# EAGLE design USB Hub (EAGLE 7.5.0)
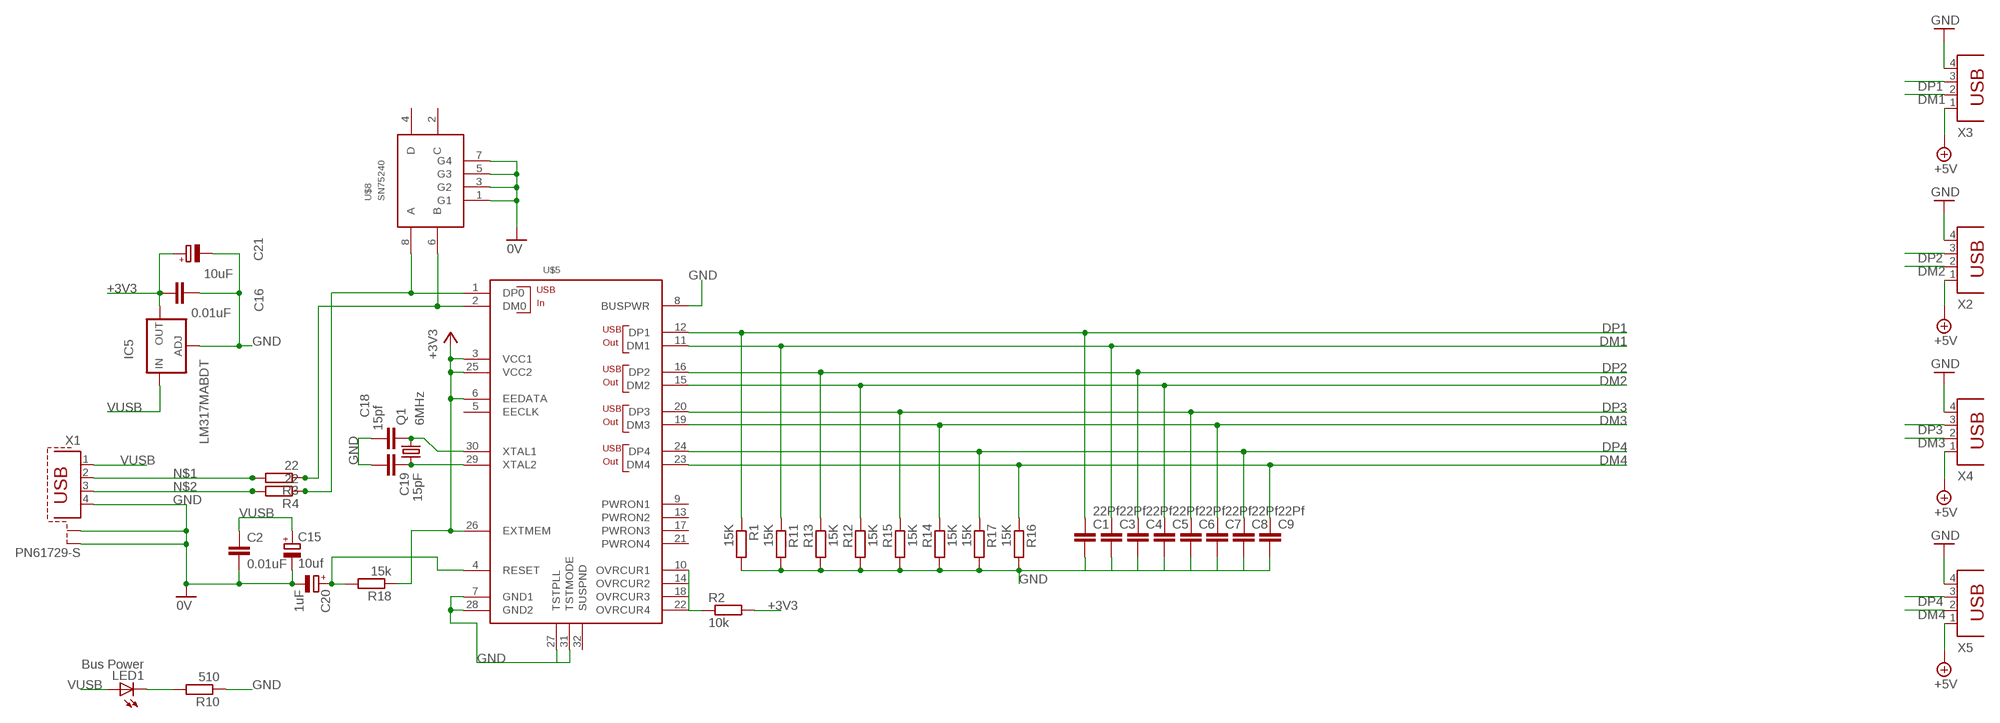
[diagram p0: schematic, sheet 1]

## Parts
C1  22Pf  C-EUC0805  [C0805]
C2  0.01uF  C-EUC0805  [C0805]
C3  22Pf  C-EUC0805  [C0805]
C4  22Pf  C-EUC0805  [C0805]
C5  22Pf  C-EUC0805  [C0805]
C6  22Pf  C-EUC0805  [C0805]
C7  22Pf  C-EUC0805  [C0805]
C8  22Pf  C-EUC0805  [C0805]
C9  22Pf  C-EUC0805  [C0805]
C15  10uf  CPOL-EUE2.5-6  [E2,5-6]
C16  0.01uF  C-EUC0805  [C0805]
C18  15pf  C-EUC0805  [C0805]
C19  15pF  C-EUC0805  [C0805]
C20  1uF  CPOL-EUE2.5-6  [E2,5-6]
C21  10uF  CPOL-EUE2.5-6  [E2,5-6]
IC5  LM317MABDT  [DPACK]
LED1  Bus Power  LEDCHIP-LED0805  [CHIP-LED0805]
Q1  6MHz  CRYSTALHC49UP  [HC49UP]
R1  15K  R-EU_R0805  [R0805]
R2  10k  R-EU_R0805  [R0805]
R3  22  R-EU_R0805  [R0805]
R4  22  R-EU_R0805  [R0805]
R10  510  R-EU_R0805  [R0805]
R11  15K  R-EU_R0805  [R0805]
R12  15K  R-EU_R0805  [R0805]
R13  15K  R-EU_R0805  [R0805]
R14  15K  R-EU_R0805  [R0805]
R15  15K  R-EU_R0805  [R0805]
R16  15K  R-EU_R0805  [R0805]
R17  15K  R-EU_R0805  [R0805]
R18  15k  R-EU_R0805  [R0805]
U$5  TUSB2046  [LQFP-32]
U$8  SN75240  [TSSOP8]
X1  PN61729-S  [PN61729-S]
X2  PN87520  [PN87520]
X3  PN87520  [PN87520]
X4  PN87520  [PN87520]
X5  PN87520  [PN87520]

## Nets
+3V3: C16.1 C21.+ IC5.4(OUT) R2.2 R18.1 U$5.3(VCC1) U$5.6(EEDATA) U$5.25(VCC2) U$5.26(EXTMEM)
DM0: R3.1 U$5.2(DM0) U$8.6(B)
DM1: C3.1 R11.1 U$5.11(DM1) X3.2
DM2: C5.1 R12.1 U$5.15(DM2) X2.2
DM3: C7.1 R14.1 U$5.19(DM3) X4.2
DM4: C9.1 R16.1 U$5.23(DM4) X5.2
DP0: R4.1 U$5.1(DP0) U$8.8(A)
DP1: C1.1 R1.1 U$5.12(DP1) X3.3
DP2: C4.1 R13.1 U$5.16(DP2) X2.3
DP3: C6.1 R15.1 U$5.20(DP3) X4.3
DP4: C8.1 R17.1 U$5.24(DP4) X5.3
GND: C1.2 C2.2 C3.2 C4.2 C5.2 C6.2 C7.2 C8.2 C9.2 C15.- C16.2 C18.1 C19.2 C20.- C21.- IC5.1(ADJ) R1.2 R10.1 R11.2 R12.2 R13.2 R14.2 R15.2 R16.2 R17.2 U$5.7(GND1) U$5.8(BUSPWR) U$5.27(TSTPLL) U$5.28(GND2) U$5.31(TSTMODE) U$8.1(G1) U$8.3(G2) U$8.5(G3) U$8.7(G4) X1.4 X1.S1 X1.S2 X2.4 X3.4 X4.4 X5.4 ; supply symbol labelled 0V
LEDV: LED1.C R10.2
N$1: R3.2 X1.2
N$2: R4.2 X1.3
N$3: R2.1 U$5.10(OVRCUR1) U$5.14(OVRCUR2) U$5.18(OVRCUR3) U$5.22(OVRCUR4)
RESET: C20.+ R18.2 U$5.4(RESET)
VCC: X2.1 X3.1 X4.1 X5.1 ; supply symbol labelled +5V
VUSB: C2.1 C15.+ IC5.3(IN) LED1.A X1.1
XTAL1: C18.2 Q1.2 U$5.30(XTAL1)
XTAL2: C19.1 Q1.1 U$5.29(XTAL2)
Unconnected: U$5.5(EECLK) U$5.9(PWRON1) U$5.13(PWRON2) U$5.17(PWRON3) U$5.21(PWRON4) U$5.32(SUSPND) U$8.2(C) U$8.4(D)

## Library data of the parts
C1-C9 C16 C18 C19 = rcl:C-EU: CAPACITOR, European symbol
C15 C20 C21 = rcl:CPOL-EU: POLARIZED CAPACITOR, European symbol
IC5 = v-reg:LM317?*: 500 mA Adjustable Output Positive Voltage Regulator Source: http://www.onsemi.co.jp .. LM317M-D.PDF
LED1 = led:LED: LED OSRAM: - CHIPLED LG R971, LG N971, LY N971, LG Q971, LY Q971, LO R971, LY R971 LH N974, LH R974 LS Q976, LO Q976, LY Q976 LO Q996 - Hyper CHIPLED LW Q18S LB Q993, LB Q99A, LB R99A - SideLED LS A670, LO A670, LY A670, LG A670, LP A670 LB A673, LV A673, LT A673, LW A673 LH A674 LY A675 LS A676, LA A676, LO A676, LY A676, LW A676 LS A679, LY A679, LG A679 - Hyper Micro SIDELED® LS Y876, LA Y876, LO Y876, LY Y876 LT Y87S - SmartLED LW L88C, LW L88S LB L89C, LB L89S, LG L890 LS L89K, LO L89K, LY L89K LS L896, LA L896, LO L896, LY L896 - TOPLED LS T670, LO T670, LY T670, LG T670, LP T670 LSG T670, LSP T670, LSY T670, LOP T670, LYG T670 LG T671, LOG T671, LSG T671 LB T673, LV T673, LT T673, LW T673 LH T674 LS T676, LA T676, LO T676, LY T676, LB T676, LH T676, LSB T676, LW T676 LB T67C, LV T67C, LT T67C, LS T67K, LO T67K, LY T67K, LW E67C LS E67B, LA E67B, LO E67B, LY E67B, LB E67C, LV E67C, LT E67C LW T67C LS T679, LY T679, LG T679 LS T770, LO T770, LY T770, LG T770, LP T770 LB T773, LV T773, LT T773, LW T773 LH T774 LS E675, LA E675, LY E675, LS T675 LS T776, LA T776, LO T776, LY T776, LB T776 LHGB T686 LT T68C, LB T68C - Hyper Mini TOPLED® LB M676 - Mini TOPLED Santana® LG M470 LS M47K, LO M47K, LY M47K Source: http://www.osram.convergy.de - LUMILED® LXK2-PW12-R00, LXK2-PW12-S00, LXK2-PW14-U00, LXK2-PW14-V00 LXK2-PM12-R00, LXK2-PM12-S00, LXK2-PM14-U00 LXK2-PE12-Q00, LXK2-PE12-R00, LXK2-PE12-S00, LXK2-PE14-T00, LXK2-PE14-U00 LXK2-PB12-K00, LXK2-PB12-L00, LXK2-PB12-M00, LXK2-PB14-N00, LXK2-PB14-P00, LXK2-PB14-Q00 LXK2-PR12-L00, LXK2-PR12-M00, LXK2-PR14-Q00, LXK2-PR14-R00 LXK2-PD12-Q00, LXK2-PD12-R00, LXK2-PD12-S00 LXK2-PH12-R00, LXK2-PH12-S00 LXK2-PL12-P00, LXK2-PL12-Q00, LXK2-PL12-R00 Source: www.luxeon.com
Q1 = new_mcp:CRYSTAL: CRYSTAL
R1-R4 R10-R18 = rcl:R-EU_: RESISTOR, European symbol
U$5 = usb-conc:TUSB2046; ORDERCODE: 1470507; SUPPLIER: farnell
U$8 = usb-conc:SN75240; ORDERCODE: 1207275; SUPPLIER: farnell
X1 = usb-conc:PN61729-S: BERG USB connector
X2-X5 = con-berg:PN87520: BERG USB connector; OC_FARNELL: unknown; OC_NEWARK: unknown

## Net classes
1 power: width 0.6 mm, clearance 0.305 mm

## Board
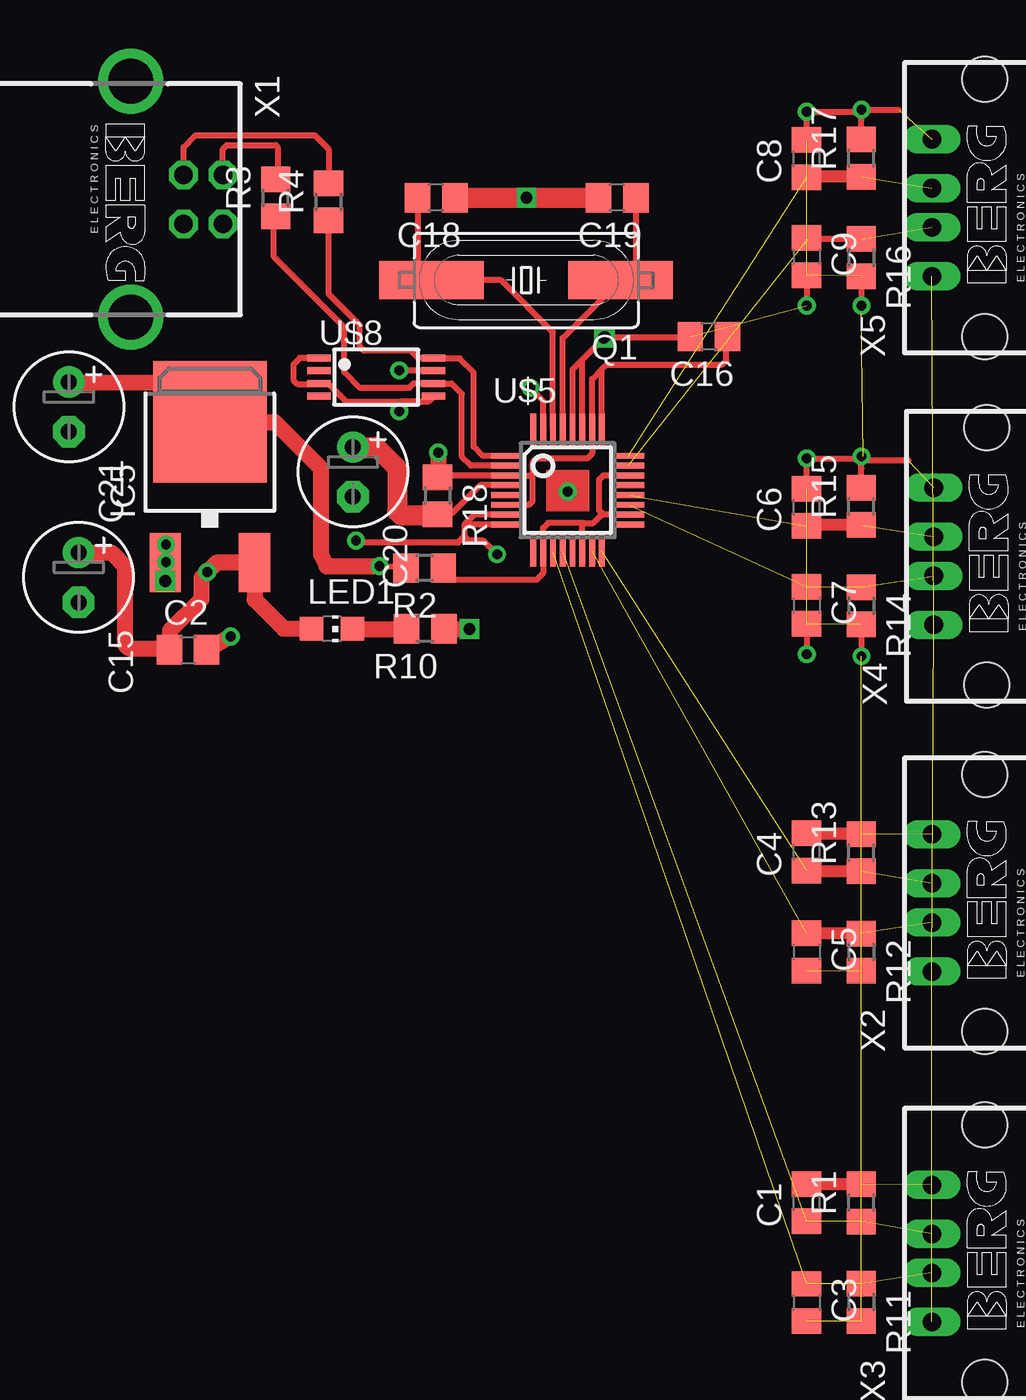
[diagram p1: board, top side]
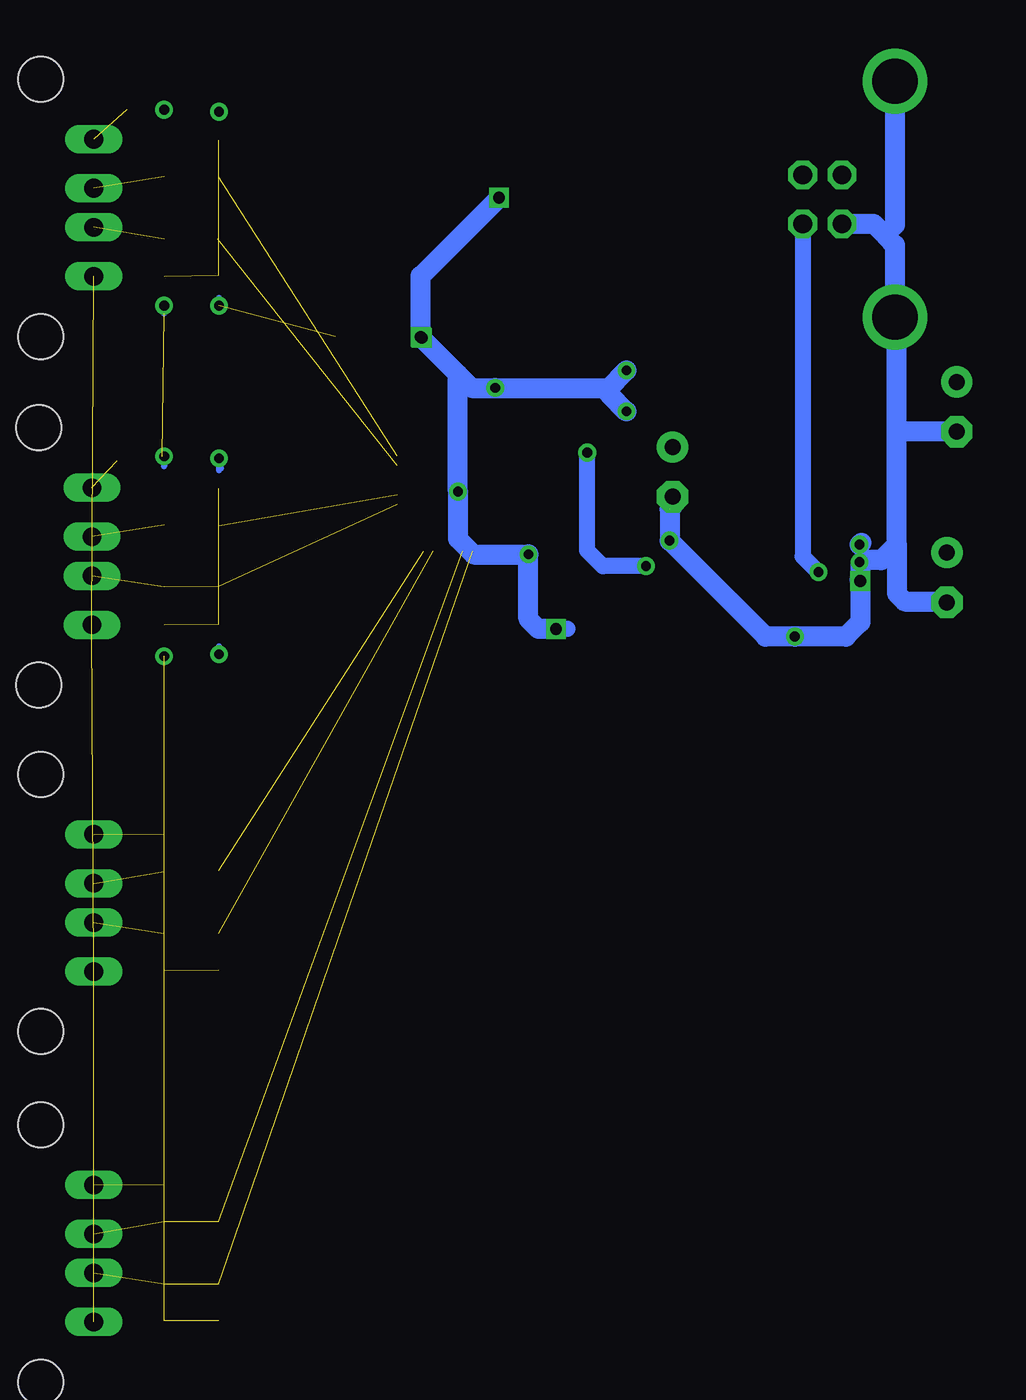
[diagram p2: board, bottom side, seen from below]

No outline drawn. Coordinates in mm, seen from the top.
Copper layers (1*16): Top 0.035mm / dielectric 1.5mm / Bottom 0.035mm
Design rules "default": minimum track width 10mil, minimum drill 24mil, track to track 8mil, track to pad 8mil, pad to pad 8mil, via to via 8mil, smd to smd 8mil, copper to edge 40mil, drill to drill 8mil, minimum pad ring 10mil, minimum via ring 8mil, stop-mask expansion 4mil, vias tented up to drill 0mil, thermal gap 10mil

### Footprints (pad centres in the part's own frame; a part is rotated, then mirrored left to right if it is on the bottom)
C0805 = smd 1.3 x 1.5: 1 -0.95,0; 2 0.95,0
E2,5-6 = drill 0.813 pad 1.6: + -1.27,0 | drill 0.813 pad 1.6 octagon: - 1.27,0
DPACK = smd 1.6 x 3: 1 -2.28,-4.8; 3 2.28,-4.8 | smd 5.8 x 6.2: 4 0,2.38
CHIP-LED0805 = smd 1.2 x 1.2: A 0,-1.05; C 0,1.05
HC49UP = smd 5.334 x 1.93: 1 -4.826,0; 2 4.826,0
R0805 = smd 1.3 x 1.5: 1 -0.95,0; 2 0.95,0
LQFP-32 = smd 0.3 x 1.6: 1 -1.75,-3.1; 2 -1.25,-3.1; 3 -0.75,-3.1; 4 -0.25,-3.1; 5 0.25,-3.1; 6 0.75,-3.1; 7 1.25,-3.1; 8 1.75,-3.1; 17 1.75,3.1; 18 1.25,3.1; 19 0.75,3.1; 20 0.25,3.1; 21 -0.25,3.1; 22 -0.75,3.1; 23 -1.25,3.1; 24 -1.75,3.1 | smd 1.6 x 0.3: 9 3.1,-1.75; 10 3.1,-1.25; 11 3.1,-0.75; 12 3.1,-0.25; 13 3.1,0.25; 14 3.1,0.75; 15 3.1,1.25; 16 3.1,1.75; 25 -3.1,1.75; 26 -3.1,1.25; 27 -3.1,0.75; 28 -3.1,0.25; 29 -3.1,-0.25; 30 -3.1,-0.75; 31 -3.1,-1.25; 32 -3.1,-1.75
TSSOP8 = smd 1.2 x 0.35: 1 -2.925,0.975; 2 -2.925,0.325; 3 -2.925,-0.325; 4 -2.925,-0.975; 5 2.925,-0.975; 6 2.925,-0.325; 7 2.925,0.325; 8 2.925,0.975
PN61729-S = drill 0.95 octagon: 1 1.25,4.71; 2 -1.25,4.71; 3 -1.25,2.71; 4 1.25,2.71 | drill 2.3 pad 2.9: S1 -6.02,0; S2 6.02,0
PN87520 = drill 0.95 long: 1 -3.5,2.71; 2 -1,2.71; 3 1,2.71; 4 3.5,2.71 | hole 2.3: -6.57,0; 6.57,0

### Placement (x,y rotation side)
C1  41.7,-24.2 90 top
C2  10.12,4.02 0 top
C3  41.7,-29.3 270 top
C4  41.7,-6.3 90 top
C5  41.7,-11.4 270 top
C6  41.7,11.3 90 top
C7  41.7,6.3 270 top
C8  41.7,29.1 90 top
C9  41.7,24.1 270 top
C15  4.54,7.72 270 top
C16  36.71,20.02 180 top
C18  22.79,27.11 180 top
C19  32.03,27.11 180 top
C20  18.54,13.11 270 top
C21  4.04,16.43 270 top
IC5  11.24,13.28 0 top
LED1  17.48,5.09 270 top
Q1  27.38,22.9 180 top
R1  44.49,-24.21 90 top
R2  22.2,8.2 180 top
R3  14.6,27.1 90 top
R4  17.3,26.9 90 top
R10  22.23,5.09 180 top
R11  44.49,-29.29 270 top
R12  44.49,-11.41 270 top
R13  44.49,-6.33 90 top
R14  44.49,6.27 270 top
R15  44.49,11.35 90 top
R16  44.49,24.05 270 top
R17  44.49,29.13 90 top
R18  22.86,11.89 270 top
U$5  29.5,12.18 270 top
U$8  19.73,17.95 0 top
X1  7.19,27.03 270 top
X2  50.8,-8.9 90 top
X3  50.8,-26.8 90 top
X4  50.9,8.8 90 top
X5  50.8,26.6 90 top

### Tracks (layer width: path | path; a pad name or v marks a point on that pad's centre or on a via)
+3V3  (via drill 0.5 pad 0.25)
  Top 0.305: 31.25,18.35 30.75,17.85 U$5.26 30.75,14.05 30.5,13.8 27.9,13.8 27.7,13.6 27.7,13 | C16.1 37.6,19.96 37.6,18.8 37.4,18.6 31.5,18.6 31.25,18.35 | U$5.25 31.25,18.35 | 22.9,12.8 R18.1 | R2.2 v19.9,8.3 | 22.9,12.88 R18.1 | R18.1 22.95,12.93 U$5.3 27.63,12.93 27.7,13 | 27.7,13 27.7,11.6 27.53,11.43 U$5.6
  Top 0.813: v22.9,14.1 22.9,12.88 | C21.+ 9.23,17.67 IC5.4 14.54,15.66 16.9,13.3 16.9,8.9 17.2,8.3 v19.9,8.3
  Bottom 0.813: v19.9,8.3 22.1,8.3 22.9,9.1 v22.9,14.1
DM0
  Top 0.305: U$5.2 24.57,13.43 24.1,13.9 24.1,17.1 23.57,17.62 U$8.6 21.62,17.62 21.4,17.4 18.9,17.4 18.1,18.2 18.1,20.5 14.5,24.1 14.5,26.05 R3.1
DM1  (3 unrouted)
DM2  (2 unrouted)
  Top 0.61: R12.1 C5.1
DM3  (3 unrouted)
DM4  (2 unrouted)
  Top 0.305: R16.1 41.75,25 C9.1
DP0
  Top 0.305: U$5.1 25.17,13.93 24.7,14.4 24.7,18.2 24,18.9 22.68,18.9 U$8.8 21.88,18.93 21.5,19.3 19.1,19.3 18.9,19.5 18.9,20.6 17.3,22.2 R4.1
DP1  (3 unrouted)
DP2  (2 unrouted)
  Top 0.61: R13.1 41.73,-7.28 C4.1
DP3  (2 unrouted)
  Top 0.61: R15.1 41.75,10.4 C6.1
DP4  (2 unrouted)
  Top 0.61: R17.1 41.73,28.18 C8.1
GND  (via drill 0.5 pad 0.25, 0.6)  (17 unrouted)
  Top 0.305: U$5.27 30.25,18.85 | 30.25,18.85 v31.35,19.95 v31.4,20 35.74,20 C16.2 | U$5.28 29.75,18.35 30.25,18.85 | U$5.31 28.25,16.75 v27.6,17.4 | U$5.7 24.73,10.93 24.23,10.43 | U$5.8 24.23,10.43 | v25.9,8.9 25.2,9.6 24.46,9.6 24.23,9.83 | 24.23,10.43 24.23,9.83 | 24.23,9.83 23.9,9.5 18.9,9.5 v18.7,9.6 | 18.7,11.2 18.7,11.18 | U$8.1 15.82,18.93 15.5,18.6 15.5,17.8 15.7,17.6 16.78,17.6 U$8.3 17.27,17.62 18.2,16.7 22.38,16.7 U$8.5 22.66,16.95 22.4,16.7 21,16.7 20.9,16.6 v20.9,16.2 | U$8.7 20.93,18.27 v20.9,18.3 | R16.2 44.49,21.91 v44.5,21.6 | C9.2 v41.7,21.6 | C8.2 v41.7,31.5 44.4,31.5 v44.5,31.6 | R17.2 44.49,31.09 v44.5,31.6 | R15.2 44.49,13.29 v44.5,13.9 | C6.2 v41.7,13.8 44.4,13.8 v44.5,13.9 | C7.2 v41.7,3.8 | R14.2 44.49,4.49 v44.5,3.7 | 46.9,13.7 44.8,13.7 44.6,13.9 v44.5,13.9 | v44.5,31.6 46.4,31.6
  Top 0.61: R1.2 C1.2 | R13.2 41.73,-5.38 C4.2 | 41.73,30.08 C8.2
  Top 0.813: C2.2 12.28,4.72 v12.3,4.7 | IC5.1 v8.96,7.54 v9,7.6 | v9,8.5 v9,9.4 | R10.1 v24.49,5.09 v24.5,5.1
  Top 1.016: C18.1 v27.4,27.11 C19.2
  Bottom 0.305: v27.6,17.4 27.8,17.2 | v25.9,8.9 26.1,8.9 | v20.9,18.3 20.7,18.3 | v20.9,16.2 20.9,16.3 | v44.5,21.6 44.5,21.2 | v41.7,21.6 41.7,22 | v44.5,13.9 44.5,13.4 | v41.7,13.8 41.7,13.2 41.6,13.3 | v41.7,3.8 41.7,4.2
  Bottom 0.813: v12.3,4.7 12.1,4.7 | v9,7.6 v9,8.5 | v9,9.4 9,9.5 | v24.5,5.1 23.9,5.1
  Bottom 1.016: v24.49,5.09 25.39,5.09 25.9,5.6 v25.9,8.9 28.7,8.9 29.5,9.7 v29.5,12.1 29.5,18.1 v31.35,19.95 | 21.8,17.4 v27.6,17.4 28.8,17.4 v31.4,20 31.4,23.11 v27.4,27.11 | 21.8,17.4 v20.9,18.3 | 21.8,17.4 21.8,17.1 v20.9,16.2 | v8.96,7.54 8.96,5.44 9.7,4.7 v12.3,4.7 13.8,4.7 v18.7,9.6 18.7,11.2 18.54,11.36 C20.- | 8.9,9.5 v9,9.4 | 7.1,9.4 7.1,15.2 | 7.1,15.2 7.1,20.92 X1.S2 7.2,24.7 7.7,25.2 | X1.4 8.28,25.78 7.7,25.2 | X1.S1 7.19,25.71 7.7,25.2 | 7.1,9.4 7.9,8.6 8.84,8.6 IC5.1 8.96,7.64 v9,7.6 | 7.1,9.4 7.1,6.9 6.7,6.5 4.59,6.5 C15.- | C21.- 7.06,15.16 7.1,15.2
LEDV
  Top 0.813: LED1.C R10.2
N$1
  Top 0.305: X1.2 11.9,29.6 12.1,29.8 14.6,29.8 14.7,29.7 14.7,28.15 R3.2
N$2
  Top 0.305: X1.3 9.9,29.7 10.5,30.3 16.6,30.3 17.3,29.6 R4.2
N$3
  Top 0.305: U$5.22 31.33,12.93 31.1,12.7 31.1,11.16 31.28,10.98 | 30.3,10.5 28.5,10.5 28.25,10.25 U$5.10 28.25,7.95 27.9,7.6 23.6,7.6 23.1,8.1 23.1,8.55 R2.1 | U$5.14 30.25,10.45 30.3,10.5 | U$5.18 31.33,10.93 31.28,10.98 | 30.3,10.5 30.8,10.5 31.28,10.98
RESET
  Top 0.305: U$5.4 25.03,12.43 23.6,11 22.92,11 R18.2 22.8,11
  Top 1.016: C20.+ 19.72,14.38 20.8,13.3 20.8,11.1 21,10.9 22.82,10.9 R18.2
VCC  (3 unrouted)
VUSB  (via drill 0.5 pad 0.25)
  Top 0.813: LED1.A 15,5.1 13.52,6.58 IC5.3 11.58,8.48 v11.1,8 10.8,7.7 10.8,6.6 9.2,5 9.2,4.05 C2.1 9.09,4.1 7.1,4.1 6.9,4.3 6.9,8.3 6.22,8.98 C15.+
  Bottom 0.813: X1.1 11.9,8.8 v11.1,8
XTAL1
  Top 0.305: U$5.30 28.75,20.25 26.1,22.9 Q1.2 21.84,23.61 C18.2
XTAL2
  Top 0.305: U$5.29 29.25,19.94 Q1.1 32.98,23.67 C19.1
(copper drawn outside any net)
  shapes: Top area x1